# Altium schematic sheet Line 3.3V.SchDoc
size A4; SheetNumber: 11; SheetTotal: 13
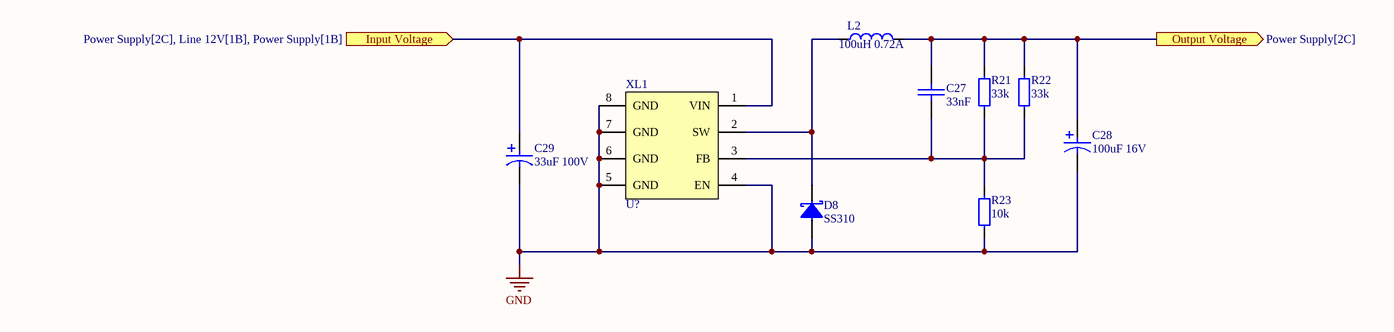
[diagram p0: Line 3.3V.SchDoc]

## Parts
C27  33nF  [0805 Capicator]
C28  100uF 16V  [BAR CAP 6.3x5.4]
C29  33uF 100V  [Bar Cap 10x10.2]
D8  SS310  [DIODE: SMB]
L2  100uH 0.72A  [CD75]
R21  33k  [RES: 0805]
R22  33k  [RES: 0805]
R23  10k  [0805 Resistor]
XL1  U?  [HSOP-8]

## Ports
Input Voltage (in, see Power Supply[2C], Line 12V[1B], Power Supply[1B]), Output Voltage (out, see Power Supply[2C])

## Nets
GND: C28.1 C29.1 D8.1 R23.1 XL1.4(EN) XL1.5(GND) XL1.6(GND) XL1.7(GND) XL1.8(GND)
Input Voltage: C29.2 XL1.1(VIN) ; port Input Voltage
Output Voltage: C27.2 C28.2 L2.2 R21.2 R22.2 ; port Output Voltage
NetC27_1: C27.1 R21.1 R22.1 R23.2 XL1.3(FB)
NetD8_2: D8.2 L2.1 XL1.2(SW)

## Library data of the parts
C27 = Cap 33nF (0805) 50V: 0805 C0G 3.3нФ 50В 5%; Part Number: GRM21BR72A333KA01L; Manufacturer: Murata Manufacturing; Type: Capacitor; ComponentLink1Description: DataSheet; ComponentLink1URL: https://static.chipdip.ru/lib/250/DOC000250694.pdf; ComponentLink2Description: Chip&Dip; ComponentLink2URL: https://www.chipdip.ru/product/grm2165c1h332ja01d
C28 = Capacitor 100uF 16V: 100uF 16V 6.3Х5.4mm; Type: Capacitor; ComponentLink1Description: Buy; ComponentLink1URL: https://radioremont.com/product/kondensator-100mkf-16v-6-3kh5-4mm-e5-8/
C29 = Capacitor 33uF 100V (10x10.2mm): EEEFK2A330P, 33uF 100V ±20% (10 X 10.2mm); Type: Capacitor; ComponentLink1Description: Buy; ComponentLink1URL: https://www.promelec.ru/product/379146/; ComponentLink2Description: Datasheet; ComponentLink2URL: https://www.promelec.ru/fs/sources/40/e5/f5/8d/12e40fc27ce05cc683b72010.pdf
D8 = Schottky diode SS310: 100B 3.0A Schottky diode; ComponentLink1Description: Buy; ComponentLink1URL: https://radioremont.com/product/diod-ss310-k181-17/#/overview/; Type: Diode; ComponentLink2Description: Datasheet; ComponentLink2URL: https://radioremont.com/wa-data/public/shop/products/99/92/9299/attachments/SS32%20–%20SS310.pdf
L2 = Inductor 100uH 0.72A: CD75-101K 100uH 0.72A; ComponentLink1Description: Buy; ComponentLink1URL: https://radioremont.com/product/drossel-cd75-101k-100-mkgn-k108-5/; ComponentLink2Description: Datasheet; ComponentLink2URL: https://www.datasheets360.com/pdf/8578292139373682111; Type: Inductor
R21 R22 = Resistor 33k (0805): 33kOhm 0805 0.125W 5%; ComponentLink1Description: Buy; ComponentLink1URL: https://radioremont.com/product/rezistor-0805-0-125-vt-5-33-kom-10-shtuk-r24-6/; Type: Resistor
R23 = Res 10k (0805): 0.125W 0805 10k, 1%; Part Number: RC0805FR-0710KL; Manufacturer: Taiwan; Type: Resistor; ComponentLink1Description: Chip&Dip; ComponentLink1URL: https://www.chipdip.ru/product0/9000079514
XL1 = DC/DC Buck XL7005A: 0.4A 150KHz 80V Buck DC to DC Converter; Type: DC/DC; ComponentLink1Description: Buy; ComponentLink1URL: https://radioremont.com/product/mikroskhema-xl7005a-e7-16/; ComponentLink2Description: Datasheet; ComponentLink2URL: https://static.chipdip.ru/lib/172/DOC013172819.pdf